# Altium schematic sheet CC2640.SchDoc: Microcontrolador CC2640
size A4; CompanyName: MUISE; Engineer: Manuel Viqueira Rodríguez; Organization: ETSI Telecomunicaciones; Address1: Av. Complutense, 30; Address2: , 28040 Madrid; Address3: Madrid; Address4: España; DocumentNumber: 3; Revision: V1.0; SheetNumber: 3; SheetTotal: 8; Engineer2: Marcos Vazquez Nuñez
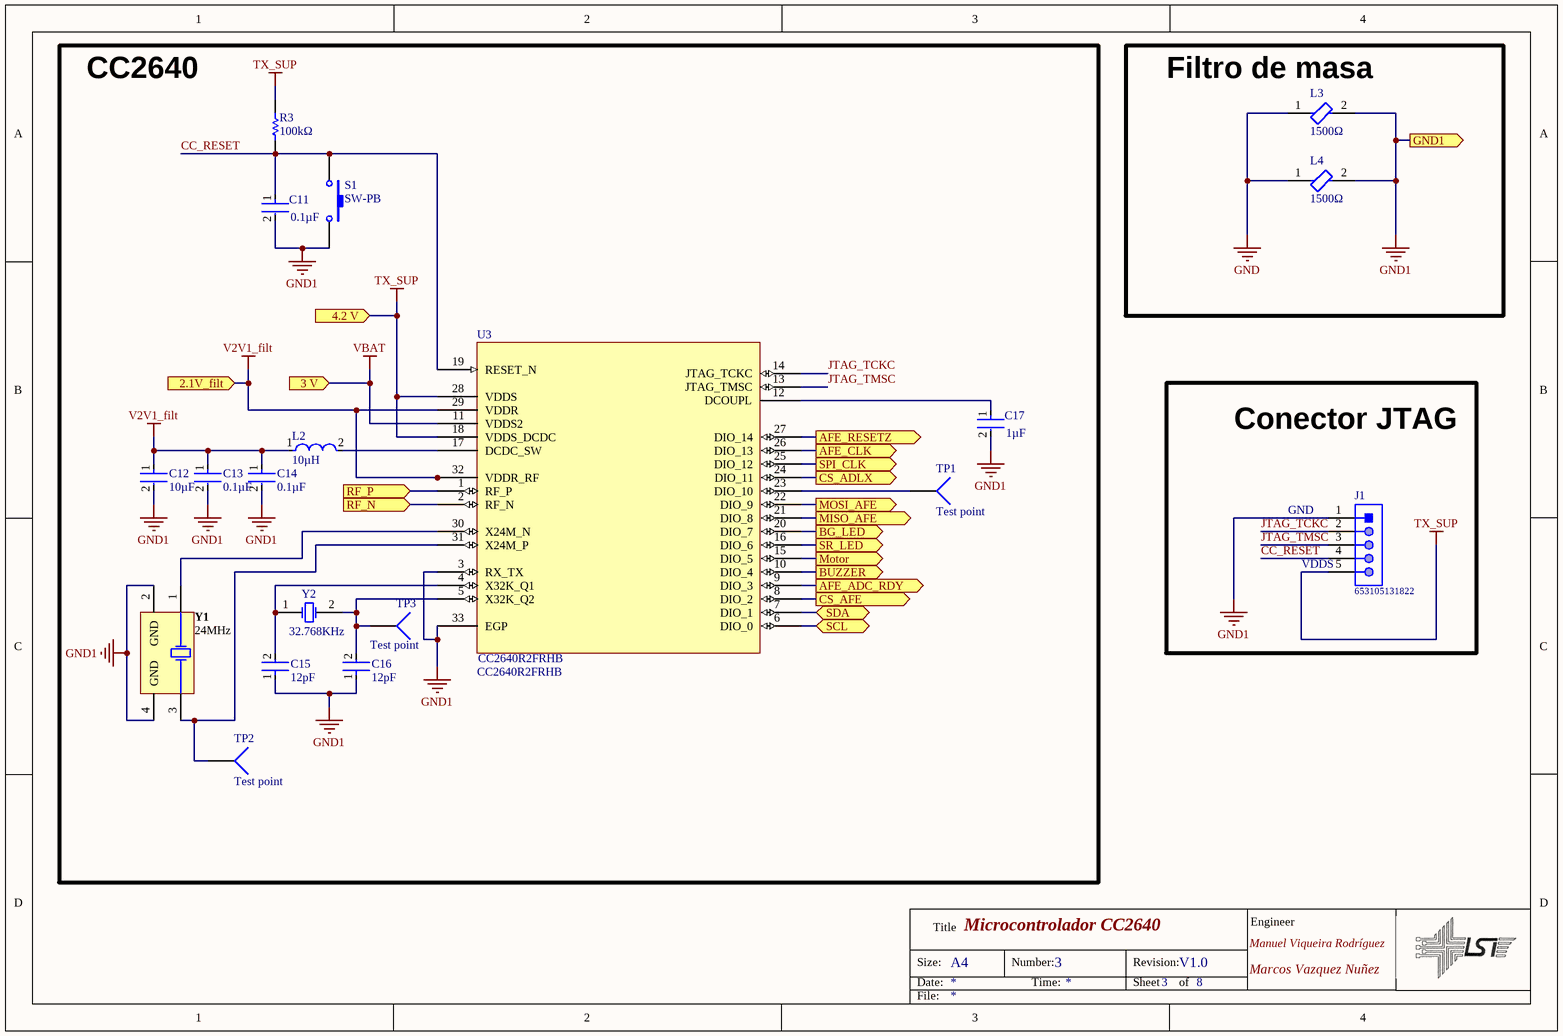
[diagram p0: CC2640.SchDoc]

## Parts
C11  0.1µF  [FP-CL10-IPC_B]
C12  10µF  [FP-CL10-IPC_B]
C13  0.1µF  [FP-CL10-IPC_B]
C14  0.1µF  [FP-CL10-IPC_B]
C15  12pF  [FP-CL10-IPC_B]
C16  12pF  [FP-CL10-IPC_B]
C17  1µF  [FP-CL10-IPC_B]
J1  653105131822  [653105131822]
L2  10µH  [FP-LQW15AN_00-W0_6-0_1-MFG]
L3  1500Ω  [FP-BLM18-0_15-t0_8-IPC_C]
L4  1500Ω  [FP-BLM18-0_15-t0_8-IPC_C]
R3  100kΩ  [RESC1005X40X25NL05T10]
S1  SW-PB  [SPST-2]
TP1  Test point  [PIN1]
TP2  Test point  [PIN1]
TP3  Test point  [PIN1]
U3  CC2640R2FRHB  [DEOP2021-Calle-Payno]
Y1  24MHz  [ABRA-ABM3B-4_V]
Y2  32.768KHz  [R38]

## Blocks framed on the sheet
CC2640: C11-C17 L2 R3 S1 TP1-TP3 U3 Y1 Y2
Filtro de masa: L3 L4
Conector JTAG: J1

## Ports
2.1V_filt (in), 3 V (in), 4.2 V (in), AFE_ADC_RDY (out), AFE_CLK (out), AFE_RESETZ (out), BG_LED (out), BUZZER (out), CS_ADLX (out), CS_AFE (out), GND1 (out), MISO_AFE (out), MOSI_AFE (out), Motor (out), RF_N (in), RF_P (in), SCL (bidir), SDA (bidir), SPI_CLK (out), SR_LED (out)

## Nets
GND: L3.1 L4.1
GND1: C11.2 C12.2 C13.2 C14.2 C15.1 C16.1 C17.2 J1.1 L3.2 L4.2 S1.2 U3.3(RX_TX) U3.33(EGP) Y1.2(GND) Y1.4(GND) ; port GND1
TX_SUP: J1.5 R3.2 U3.18(VDDS_DCDC) U3.28(VDDS) ; port 4.2 V
V2V1_filt: C12.1 C13.1 C14.1 L2.1 U3.29(VDDR) U3.32(VDDR_RF) ; port 2.1V_filt
VBAT: U3.11(VDDS2) ; port 3 V
AFE_ADC_RDY: U3.9(DIO_3) ; port AFE_ADC_RDY
AFE_CLK: U3.26(DIO_13) ; port AFE_CLK
AFE_RESETZ: U3.27(DIO_14) ; port AFE_RESETZ
BG_LED: U3.20(DIO_7) ; port BG_LED
BUZZER: U3.10(DIO_4) ; port BUZZER
CC_RESET: C11.1 J1.4 R3.1 S1.1 U3.19(RESET_N)
CS_ADLX: U3.24(DIO_11) ; port CS_ADLX
CS_AFE: U3.8(DIO_2) ; port CS_AFE
JTAG_TCKC: J1.2 U3.14(JTAG_TCKC)
JTAG_TMSC: J1.3 U3.13(JTAG_TMSC)
MISO_AFE: U3.21(DIO_8) ; port MISO_AFE
MOSI_AFE: U3.22(DIO_9) ; port MOSI_AFE
Motor: U3.15(DIO_5) ; port Motor
RF_N: U3.2(RF_N) ; port RF_N
RF_P: U3.1(RF_P) ; port RF_P
SCL: U3.6(DIO_0) ; port SCL
SDA: U3.7(DIO_1) ; port SDA
SPI_CLK: U3.25(DIO_12) ; port SPI_CLK
SR_LED: U3.16(DIO_6) ; port SR_LED
NetC15_2: C15.2 U3.4(X32K_Q1) Y2.1(OSC1)
NetC16_2: C16.2 TP3.1 U3.5(X32K_Q2) Y2.2(OSC2)
NetC17_1: C17.1 U3.12(DCOUPL)
NetL2_2: L2.2 U3.17(DCDC_SW)
NetTP1_1: TP1.1 U3.23(DIO_10)
NetTP2_1: TP2.1 U3.31(X24M_P) Y1.3(X2)
NetU3_30: U3.30(X24M_N) Y1.1(X1)

## Notes on the sheet
- (near J1) GND
- (near J1) VDDS
- Size:
- Date:
- Title
- A4
- Number:
- Time:
- Revision:
- Sheet
- of
- Engineer
- File:

## Library data of the parts
C11-C17 = CMP-13271-003245-1: Cap Ceramic 10uF 10V X5R ±10% Pad SMD 0603 +85°C T/R; Packaging: Tape and Reel; Dielectric: X5R; Min Operating Temperature: -55°C; Lead Free: Lead Free; Height: 0.8mm; Package Quantity: 10000; Voltage Rating (DC): 10V; Mount: Surface Mount; Tolerance: 10%; Width: 0.031inch; Thickness: 0.035inch; Depth: 0.8mm; Max Operating Temperature: 85°C; Capacitance: 10uF; Case/Package: 0603; Length: 1.6mm; Voltage Rating: 10V; Radiation Hardening: No
J1 = CMP-1502-00774-1: Male Shrouded Header WR-WTB, SMT, Right Angled, pitch 1.25 mm, 1 x 5 position; Manufacturer: Wurth Elektronik; Contact Resistance: 20mOhm; Working Voltage: 125VAC; Position: 1x5; Pitch: 1.25mm; Datasheet URL: https://katalog.we-online.de/em/datasheet/6531xx131822.pdf; Orientation: RightAngled; Package Reference: 653105131822; Operating Temperature: -40to85degC; Gender: Male; Publisher: WurthElektronik; Mounting Technology: SMT; Packaging: TapeandReel; Manufacturer URL: http://www.we-online.de; Part Number: 653105131822
L2 = CMP-2000-06595-2: Wire Wound RF Inductor 15nH ±5% 460mA 0.16Ω 0402 (1005); Test Frequency: 100MHz; DC Resistance (DCR): 160mR; Shielding: Unshielded; Q Factor: 30; Core Material: Air; Self Resonant Frequency: 5GHz; Resistor Type: Wirewound; DC Current: 460mA; Inductance: 15nH; Weight: 2.8E-05oz; Radiation Hardening: No; Depth: 0.7mm; Package Quantity: 10000; Case/Package: 0402; Packaging: Tape and Reel; Length: 1mm; Max DC Current: 460mA; Case Code (Imperial): 0402; Tolerance: 5%; Min Operating Temperature: -55°C; Lead Free: Lead Free; Width: 0.02inch; Case Code (Metric): 1005; Termination: SMD/SMT; Military Standard: Not; Current Rating: 460mA; Height: 0.5mm; Mount: Surface Mount; Max Operating Temperature: 125°C
L3 L4 = CMP-0686-00368-3: Chip Ferrite Bead, 0603, 1500Ω @ 100MHz, 0.5Ω, 25%, 500mA; Impedance: 1.5kR; DC Resistance (DCR): 500mR; Number of Circuits: 1; Test Frequency: 100MHz; Case/Package: 0603; Max Operating Temperature: 125°C; Package Quantity: 1; Max DC Current: 500mA; Tolerance: 25%; Core Material: Ferrite; Width: 0.8mm; Number of Pins: 2; Depth: 0.8mm; Radiation Hardening: No; Case Code (Imperial): 0603; Min Operating Temperature: -55°C; Termination: SMD/SMT; Material: Ferrite; Military Standard: Not; Number of Lines: 1; DC Current: 500mA; Length: 1.6mm; REACH SVHC: No SVHC; Lead Free: Lead Free; Current Rating: 500mA; Max Current Rating: 500mA; Packaging: Tape and Reel; Case Code (Metric): 1608; Height: 0.8mm
R3 = CMP-2002-06462-1: Part Number: ERJ-U02F1501X; Manufacturer: Panasonic
S1 = SW-PB: Switch; Published: 24-Mar-1999; LatestRevisionDate: 17-Jul-2002; LatestRevisionNote: Re-released for DXP Platform.; PackageReference: SPST-2; Publisher: Altium Limited; PackageDescription: Switch; 2 Leads
TP1-TP3 = Socket: LatestRevisionDate: 17-Jul-2002; LatestRevisionNote: Re-released for DXP Platform.; Publisher: Altium Limited
Y1 = CMP-1688-00008-1: Ceramic SMD Crystal, 24 MHz, +/- 20 ppm, 50 Ohm, -20 to 70 degC, 4-Pin SMD, RoHS, Tape and Reel; Impedance: 50 Ohm; Mating Cycles: 30; Frequency: 6 Hz; Contact Material: Brass; Contact Plating: Gold; PackageReference: ABM3B; Min Operating Temperature: -40 degC; ComponentLink2Description: Datasheet; Radiation Hardening: No; DatasheetVersion: Aug-15; Packaging: Tape and Reel; Length: 2.6 mm; Package Quantity: 2500; REACH SVHC: Unknown; PackageDescription: 4-Pin Surface Mount Device, Body 5 x 3.2 mm; Weight: 0.001058 oz; ComponentLink2URL: http://www.abracon.com/Resonators/abm3b.pdf; ComponentLink1Description: Manufacturer URL; Width: 3 mm; RoHSCompliant: true; Fastening Type: Snap; Max Operating Temperature: 155 degC; ComponentLink1URL: http://www.abracon.com/; Height: 1.244 mm; Mount: Surface Mount
Y2 = XTAL: Crystal Oscillator; Published: 8-Jun-2000; LatestRevisionDate: 17-Jul-2002; LatestRevisionNote: Re-released for DXP Platform.; PackageReference: R38; Publisher: Altium Limited; PackageDescription: Crystal, Thru-Hole; 2 Leads; Body 3.1 x 8.2 mm (Dia.xH)